# EAGLE design sdr_3157 (EAGLE 9.6.2)
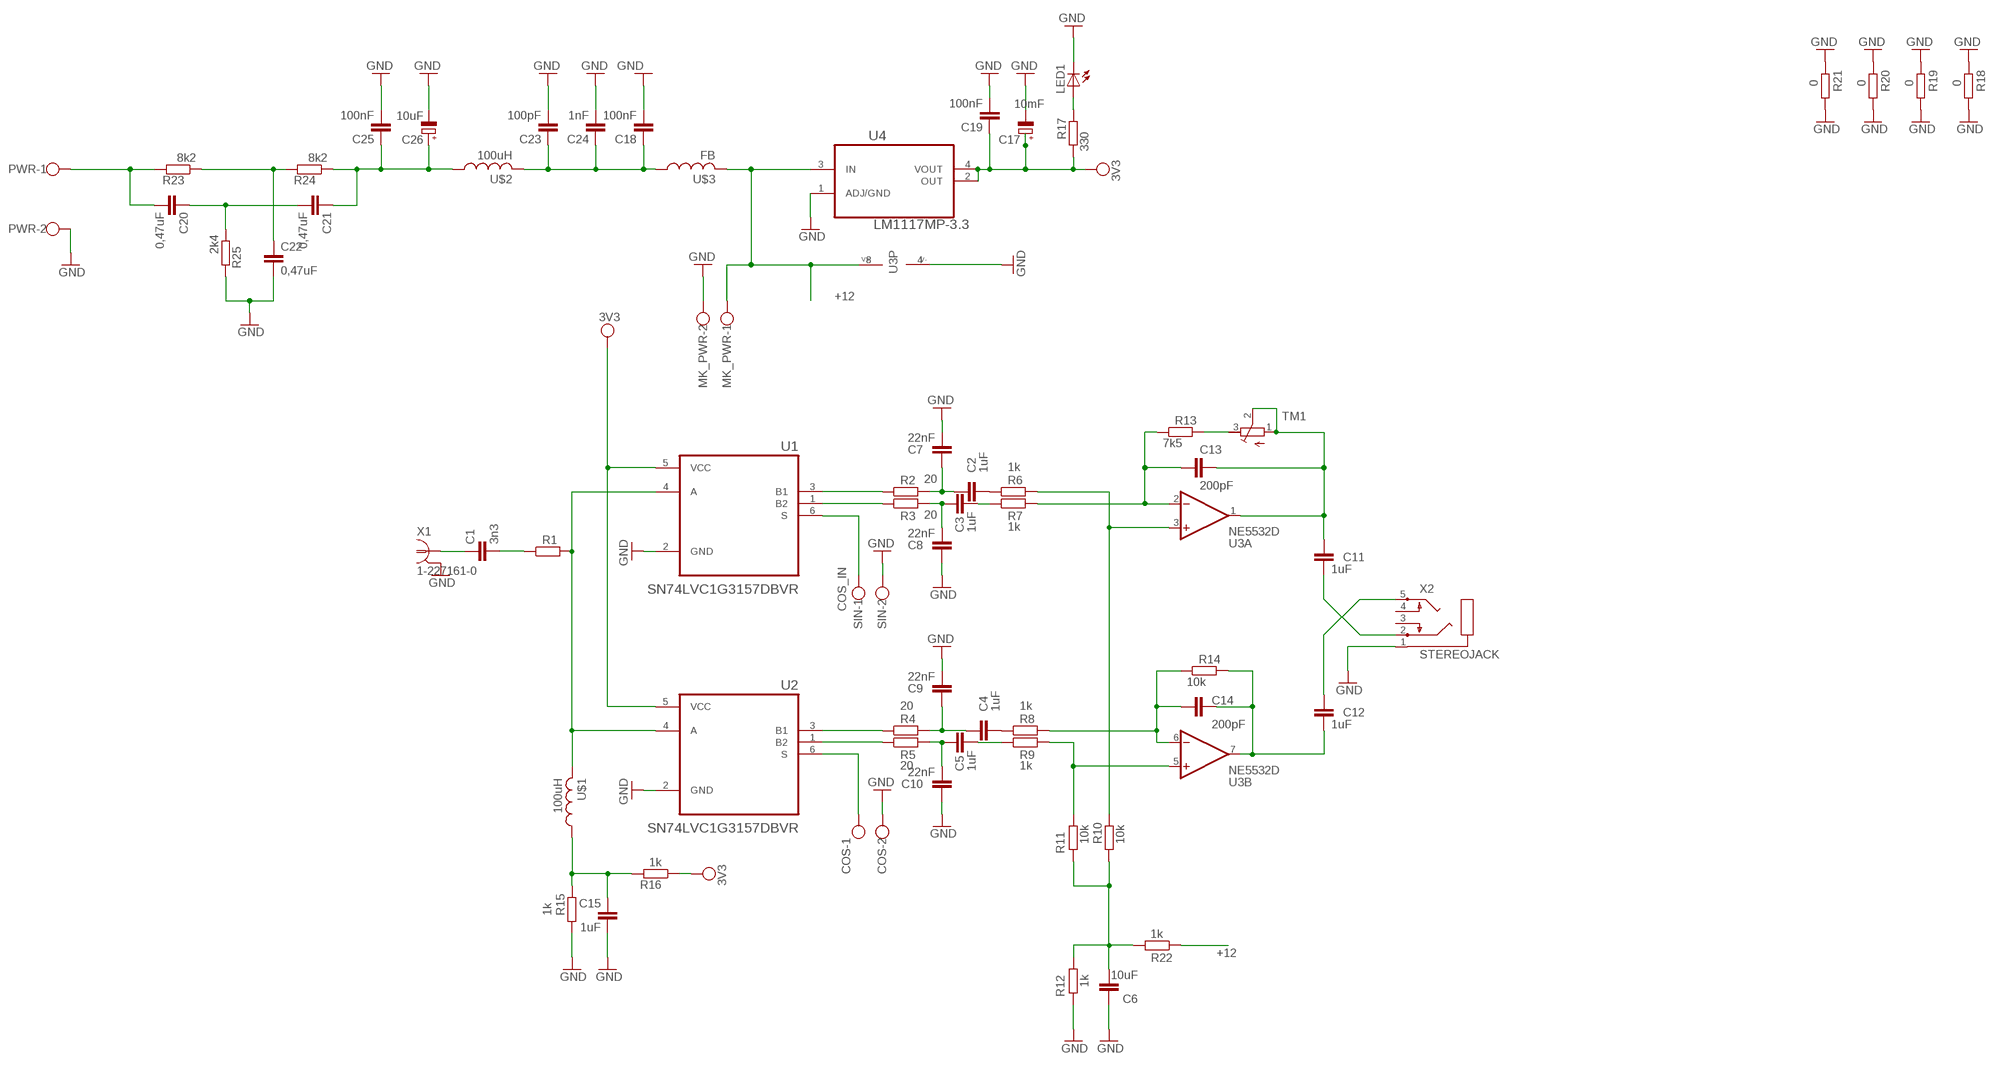
[diagram p0: schematic, sheet 1]

## Parts
C1  3n3  C-EUC0805  [C0805]
C2  1uF  C-EUC0805  [C0805]
C3  1uF  C-EUC0805  [C0805]
C4  1uF  C-EUC0805  [C0805]
C5  1uF  C-EUC0805  [C0805]
C6  10uF  C-EUC0805  [C0805]
C7  22nF  C-EUC0805  [C0805]
C8  22nF  C-EUC0805  [C0805]
C9  22nF  C-EUC0805  [C0805]
C10  22nF  C-EUC0805  [C0805]
C11  1uF  C-EUC1210K  [C1210K]
C12  1uF  C-EUC1210K  [C1210K]
C13  200pF  C-EUC0805  [C0805]
C14  200pF  C-EUC0805  [C0805]
C15  1uF  C-EUC0805  [C0805]
C17  10mF  CPOL-EUSMCC  [SMC_C]
C18  100nF  C-EUC0805  [C0805]
C19  100nF  C-EUC0805  [C0805]
C20  0,47uF  C-EUC0805  [C0805]
C21  0,47uF  C-EUC0805  [C0805]
C22  0,47uF  C-EUC0805  [C0805]
C23  100pF  C-EUC0805  [C0805]
C24  1nF  C-EUC0805  [C0805]
C25  100nF  C-EUC0805  [C0805]
C26  10uF  CPOL-EUSMCC  [SMC_C]
COS  W237-102  [W237-102]
LED1  LEDSMT1206  [1206]
MK_PWR  W237-102  [W237-102]
PWR  W237-102  [W237-102]
R1  R-EU_R0805  [R0805]
R2  20  R-EU_R0805  [R0805]
R3  20  R-EU_R0805  [R0805]
R4  20  R-EU_R0805  [R0805]
R5  20  R-EU_R0805  [R0805]
R6  1k  R-EU_R0805  [R0805]
R7  1k  R-EU_R0805  [R0805]
R8  1k  R-EU_0204/7  [0204/7]
R9  1k  R-EU_R0805  [R0805]
R10  10k  R-EU_R0805  [R0805]
R11  10k  R-EU_0207/12  [0207/12]
R12  1k  R-EU_M0805  [M0805]
R13  7k5  R-EU_R0805  [R0805]
R14  10k  R-EU_R0805  [R0805]
R15  1k  R-EU_R0805  [R0805]
R16  1k  R-EU_R0805  [R0805]
R17  330  R-EU_R0805  [R0805]
R18  0  R-EU_0207/12  [0207/12]
R19  0  R-EU_0207/5V  [0207/5V]
R20  0  R-EU_0204/7  [0204/7]
R21  0  R-EU_0207/12  [0207/12]
R22  1k  R-EU_M0805  [M0805]
R23  8k2  R-EU_R0805  [R0805]
R24  8k2  R-EU_R0805  [R0805]
R25  2k4  R-EU_R0805  [R0805]
SIN  W237-102  [W237-102]
TM1  5k  R-TRIMM3296W  [RTRIM3296W]
U1  SN74LVC1G3157DBVR  [SOT95P280X145-6N]
U2  SN74LVC1G3157DBVR  [SOT95P280X145-6N]
U3  NE5532D  [SO08]
U4  LM1117MP-3.3  [SOT230P696X180-4N]
U$1  100uH  L-LQH55  [LQH55]
U$2  100uH  L-LQH55  [LQH55]
U$3  FB  [FB]
X1  1-227161-0  [AMP_227161]
X2  STEREOJACK  [STX3100]

## Nets
+12: MK_PWR.1 R22.1 U3.8(P:V+) U4.3(IN) U$3.P$2
COS_IN: SIN.1 U1.6(S)
GND: C6.1 C7.2 C8.1 C9.2 C10.1 C15.1 C17.- C18.2 C19.2 C22.2 C23.2 C24.2 C25.2 C26.- COS.2 LED1.C MK_PWR.2 PWR.2 R12.1 R15.1 R18.1 R18.2 R19.1 R19.2 R20.1 R20.2 R21.1 R21.2 R25.2 SIN.2 U1.2(GND) U2.2(GND) U3.4(P:V-) U4.1(ADJ/GND) X1.2 X2.1
N$1: R1.2 U1.4(A) U2.4(A) U$1.2
N$2: C1.2 R1.1
N$3: R2.1 U1.3(B1)
N$4: R3.1 U1.1(B2)
N$5: R4.1 U2.3(B1)
N$6: C1.1 X1.1
N$7: R5.1 U2.1(B2)
N$8: C2.1 C7.1 R2.2
N$9: C3.1 C8.2 R3.2
N$10: C4.1 C9.1 R4.2
N$11: C5.1 C10.2 R5.2
N$12: C2.2 R6.1
N$13: C3.2 R7.1
N$14: C4.2 R8.1
N$15: C5.2 R9.1
N$16: R6.2 R10.2 U3.3(A:+IN)
N$17: C13.1 R7.2 R13.1 U3.2(A:-IN)
N$18: R9.2 R11.2 U3.5(B:+IN)
N$19: C14.1 R8.2 R14.1 U3.6(B:-IN)
N$20: C6.2 R10.1 R11.1 R12.2 R22.2
N$21: C11.1 C13.2 TM1.1(A) TM1.2(S) U3.1(A:OUT)
N$22: C11.2 X2.2
N$23: C12.1 X2.5
N$24: C12.2 C14.2 R14.2 U3.7(B:OUT)
N$25: C15.2 R15.2 R16.2 U$1.1
N$26: LED1.A R17.2
N$27: C20.2 PWR.1 R23.2
N$28: R13.2 TM1.3(E)
N$29: C22.1 R23.1 R24.2
N$30: C20.1 C21.2 R25.1
N$31: COS.1 U2.6(S)
N$32: C21.1 C25.1 C26.+ R24.1 U$2.1
N$33: C18.1 C23.1 C24.1 U$2.2 U$3.P$1
VCC: C17.+ C19.1 R16.1 R17.1 U1.5(VCC) U2.5(VCC) U4.2(OUT) U4.4(VOUT) ; supply symbol labelled 3V3
Unconnected: X2.3 X2.4

## Library data of the parts
C1-C15 C18-C25 = rcl:C-EU: CAPACITOR, European symbol; SPICEPREFIX: C
C17 C26 = rcl:CPOL-EU: POLARIZED CAPACITOR, European symbol; SPICEPREFIX: C
COS MK_PWR PWR SIN = con-wago-500:W237-102: WAGO SCREW CLAMP; MPN: 237-102; OC_FARNELL: unknown; OC_NEWARK: 70K9898
LED1 = adafruit:LED: LED OSRAM: - CHIPLED LG R971, LG N971, LY N971, LG Q971, LY Q971, LO R971, LY R971 LH N974, LH R974 LS Q976, LO Q976, LY Q976 LO Q996 - Hyper CHIPLED LW Q18S LB Q993, LB Q99A, LB R99A - SideLED LS A670, LO A670, LY A670, LG A670, LP A670 LB A673, LV A673, LT A673, LW A673 LH A674 LY A675 LS A676, LA A676, LO A676, LY A676, LW A676 LS A679, LY A679, LG A679 - Hyper Micro SIDELED® LS Y876, LA Y876, LO Y876, LY Y876 LT Y87S - SmartLED LW L88C, LW L88S LB L89C, LB L89S, LG L890 LS L89K, LO L89K, LY L89K LS L896, LA L896, LO L896, LY L896 - TOPLED LS T670, LO T670, LY T670, LG T670, LP T670 LSG T670, LSP T670, LSY T670, LOP T670, LYG T670 LG T671, LOG T671, LSG T671 LB T673, LV T673, LT T673, LW T673 LH T674 LS T676, LA T676, LO T676, LY T676, LB T676, LH T676, LSB T676, LW T676 LB T67C, LV T67C, LT T67C, LS T67K, LO T67K, LY T67K, LW E67C LS E67B, LA E67B, LO E67B, LY E67B, LB E67C, LV E67C, LT E67C LW T67C LS T679, LY T679, LG T679 LS T770, LO T770, LY T770, LG T770, LP T770 LB T773, LV T773, LT T773, LW T773 LH T774 LS E675, LA E675, LY E675, LS T675 LS T776, LA T776, LO T776, LY T776, LB T776 LHGB T686 LT T68C, LB T68C - Hyper Mini TOPLED® LB M676 - Mini TOPLED Santana® LG M470 LS M47K, LO M47K, LY M47K Source: http://www.osram.convergy.de/
R1-R25 = rcl:R-EU_: RESISTOR, European symbol; SPICEPREFIX: R
TM1 = rcl:R-TRIMM: Trimm resistor; SPICEMODEL: X; SPICEPREFIXL: POT
U1 U2 = SN74LVC1G3157DBVR:SN74LVC1G3157DBVR: Check prices <https://pricing.snapeda.com/parts/SN74LVC1G3157DBVR/Texas%20Instruments/view-part?ref=eda>; AVAILABILITY: In Stock; DESCRIPTION: 5-V, 2:1 (SPDT), 1-channel general-purpose analog switch 6-SOT-23 -40 to 125; MF: Texas Instruments; MP: SN74LVC1G3157DBVR; PACKAGE: SOT-23-6 Texas Instruments; PRICE: None; PURCHASE-URL: https://pricing.snapeda.com/search/part/SN74LVC1G3157DBVR/?ref=eda
U3 = op-amp:NE5532: OP-AMP
U4 = LM1117MP-3.3:LM1117MP-3.3: Linear regulators Check prices <https://pricing.snapeda.com/parts/LM1117MP-3.3/Texas%20Instruments/view-part?ref=eda>; AVAILABILITY: In Stock; DESCRIPTION: Linear Voltage Regulator IC Positive Fixed 1 Output 800mA SOT-223; MF: Texas Instruments; MP: LM1117MP-3.3; PACKAGE: SOT-223-3 Texas Instruments; PRICE: None; PURCHASE-URL: https://pricing.snapeda.com/search/part/LM1117MP-3.3/?ref=eda
U$1 U$2 = adafruit:L
U$3 = adafruit:FB: Ferrite bead Digikey #P9821BK-ND
X1 = !con-coax:?227161*: JACK, RIGHT ANGLE, 50 OHM, PCB, BNC Source: amp_227161.pdf; MF: TYCO ELECTRONICS; MPN: 1-227161; OC_FARNELL: unknown; OC_NEWARK: 33B3200
X2 = adafruit:STEREOJACK: MIC/HEADPHONE JACK Stereo jack with two switches. Kycon STX3100, CUI SJ1-3555NG and/or 4UCon 05544

## Board
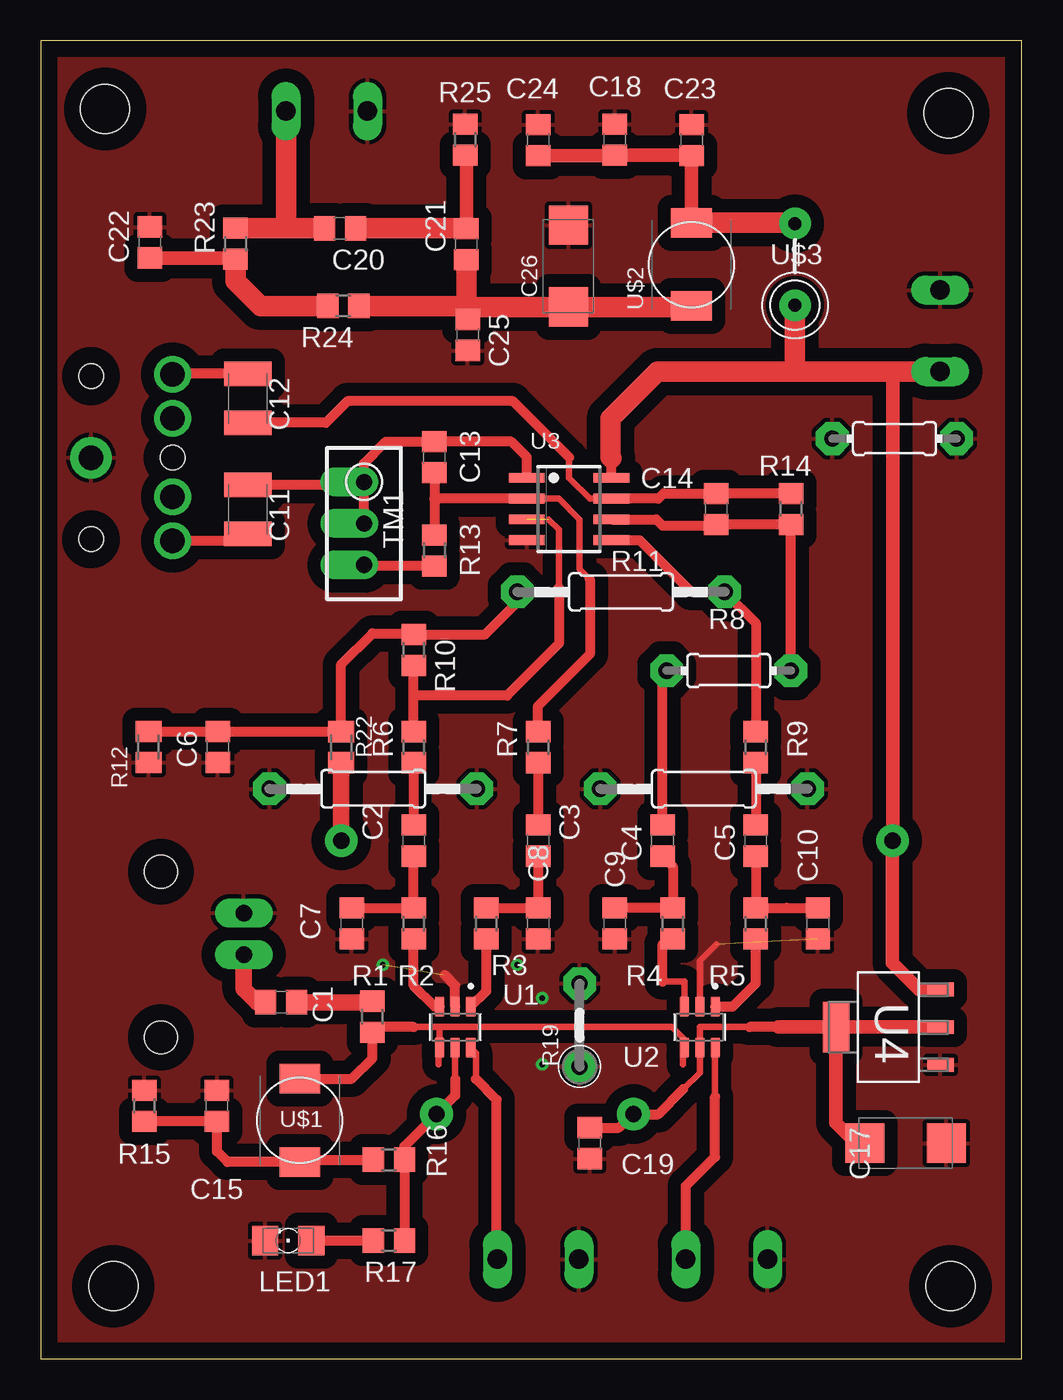
[diagram p1: board, top side]
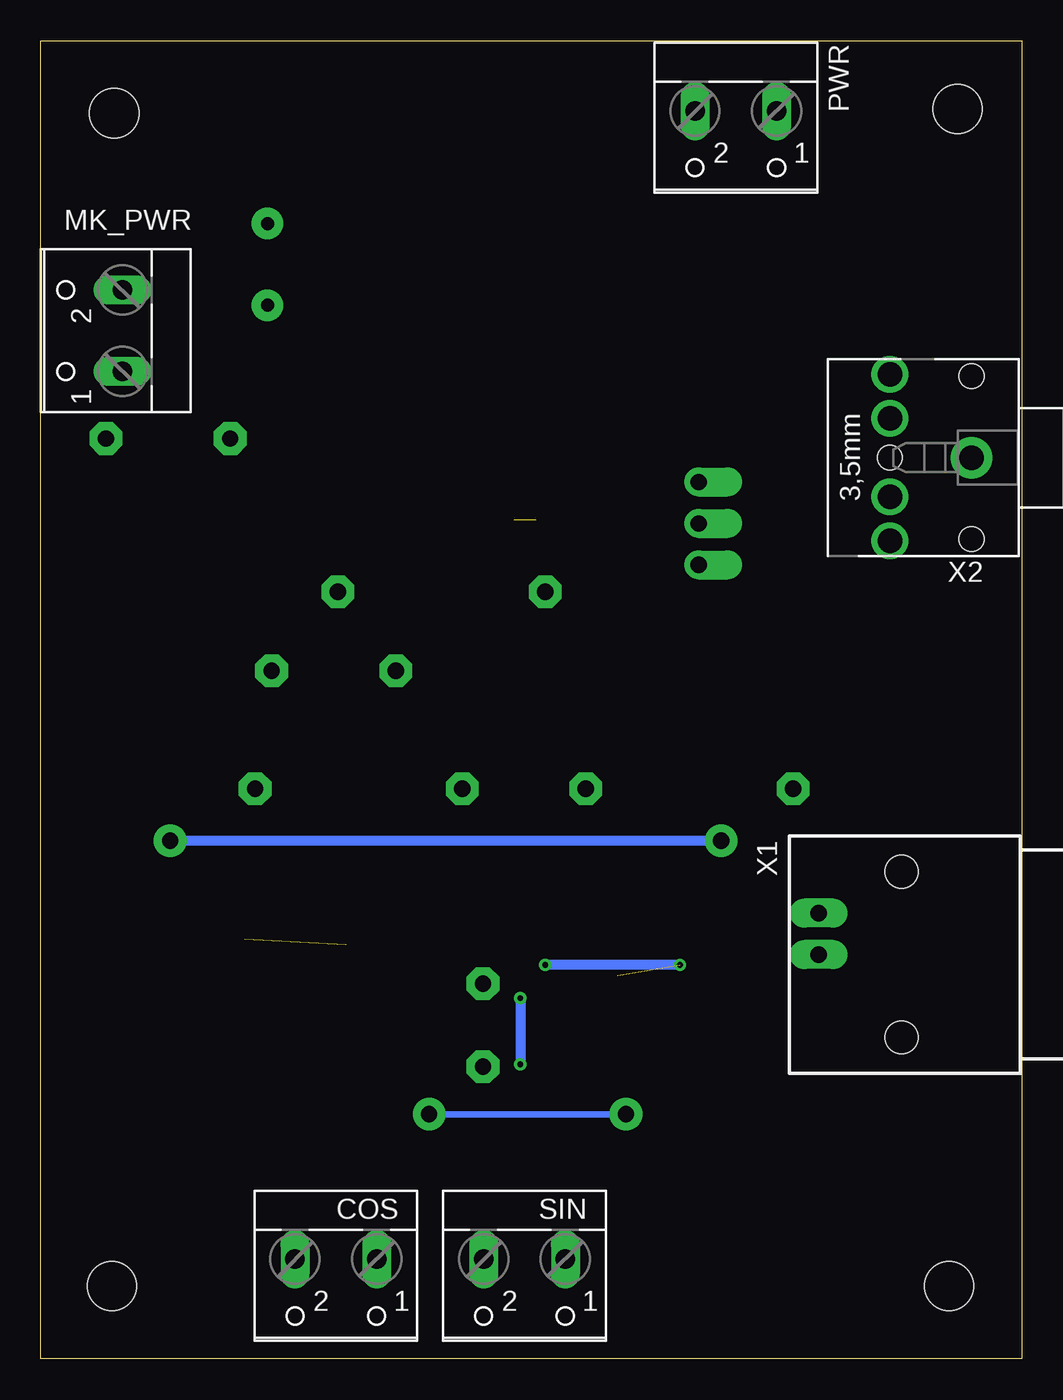
[diagram p2: board, bottom side, seen from below]

Size 60.12 x 80.76 mm. Coordinates in mm from the lower left corner, seen from the top.
Outline: 0,0 60.12,0 60.12,80.76 0,80.76 0,0
Copper layers (1*16): Top 0.035mm / dielectric 1.5mm / Bottom 0.035mm
Design rules "default": minimum track width 6mil, minimum drill 0.35mm, track to track 6mil, track to pad 6mil, pad to pad 6mil, via to via 6mil, smd to smd 6mil, copper to edge 40mil, drill to drill 6mil, minimum pad ring 10mil, minimum via ring 8mil, stop-mask expansion 4mil, vias tented up to drill 0mil, thermal gap 10mil
Holes 3 mm at 4.45,4.45 3.94,76.58 55.63,76.33 55.75,4.45

### Footprints (pad centres in the part's own frame; a part is rotated, then mirrored left to right if it is on the bottom)
C0805 = smd 1.3 x 1.5: 1 -0.95,0; 2 0.95,0
C1210K = smd 1.5 x 2.9: 1 -1.5,0; 2 1.5,0
SMC_C = smd 2.4 x 2.4: + -2.5,0; - 2.5,0
W237-102 = drill 1.194 long: 1 -2.5,-1.27; 2 2.5,-1.27
1206 = smd 1.6 x 1.803: A -1.422,0; C 1.422,0
R0805 = smd 1.3 x 1.5: 1 -0.95,0; 2 0.95,0
0204/7 = drill 1 pad 2 octagon: 1 -3.81,0; 2 3.81,0
0207/12 = drill 1 pad 2 octagon: 1 -6.35,0; 2 6.35,0
M0805 = smd 1.3 x 1.6: 1 -0.95,0; 2 0.95,0
0207/5V = drill 1 pad 2 octagon: 1 -2.54,0; 2 2.54,0
RTRIM3296W = drill 1 pad 1.778 offset: 1 0,-2.54; 2 0,0; 3 0,2.54
SOT95P280X145-6N = smd 1.21 x 0.58: 1 -1.255,0.95; 2 -1.255,0; 3 -1.255,-0.95; 4 1.255,-0.95; 5 1.255,0; 6 1.255,0.95
SO08 = smd 0.6 x 2.2: 1 -1.905,-2.6; 2 -0.635,-2.6; 3 0.635,-2.6; 4 1.905,-2.6; 5 1.905,2.6; 6 0.635,2.6; 7 -0.635,2.6; 8 -1.905,2.6
SOT230P696X180-4N = smd 1.6 x 0.838: 1 -3.2,2.311; 2 -3.2,0; 3 -3.2,-2.311 | smd 1.6 x 3.099: 4 3.2,0
LQH55 = smd 1.8 x 2.5: 1 -2.55,0; 2 2.55,0
FB = drill 0.8 pad 1.93: P$1 -2.5,0; P$2 2.5,0
AMP_227161 = drill 1 pad 1.778 long: 1 0,-5.08; 2 -2.54,-5.08 | hole 2: -5.08,0; 5.08,0
STX3100 = drill 1.5 pad 2.54: 1 2.7,-0.1 | drill 1.5: 2 7.7,5; 3 7.7,2.3; 4 7.7,-2.5; 5 7.7,-5.2 | hole 1.5: 2.7,4.9; 2.7,-5.1; 7.7,-0.1

### Placement (x,y rotation side)
C1  14.73,21.84 0 top
C2  22.86,31.75 90 top
C3  30.48,31.75 90 top
C4  38.1,31.75 90 top
C5  43.81,31.75 90 top
C6  10.85,37.49 90 top
C7  19.05,26.67 270 top
C8  30.48,26.67 90 top
C9  35.18,26.67 270 top
C10  47.62,26.67 90 top
C11  12.7,52.05 270 top
C12  12.7,58.85 270 top
C13  24.13,55.24 90 top
C14  41.4,52.07 90 top
C15  10.79,15.49 270 top
C17  53,13.21 0 top
C18  35.18,74.7 90 top
C19  33.66,13.21 270 top
C20  18.34,69.27 180 top
C21  26.09,68.3 90 top
C22  6.68,68.4 90 top
C23  39.88,74.68 90 top
C24  30.48,74.68 90 top
C25  26.16,62.74 270 top
C26  32.33,66.95 90 top
COS  42.04,4.83 180 bottom
LED1  15.16,7.24 180 top
MK_PWR  56.39,62.99 90 bottom
PWR  17.53,75.18 180 bottom
R1  20.32,20.95 270 top
R2  22.86,26.67 90 top
R3  27.3,26.67 90 top
R4  38.73,26.67 90 top
R5  43.81,26.67 90 top
R6  22.86,37.47 90 top
R7  30.48,37.47 90 top
R8  42.16,42.16 0 top
R9  43.81,37.47 90 top
R10  22.86,43.43 270 top
R11  35.56,46.99 0 top
R12  6.6,37.49 90 top
R13  24.13,49.53 270 top
R14  45.97,52.07 90 top
R15  6.35,15.49 270 top
R16  21.34,12.19 180 top
R17  21.34,7.24 180 top
R18  40.64,34.92 0 top
R19  33.02,20.45 90 top
R20  52.32,56.39 180 top
R21  20.37,34.92 0 top
R22  18.41,37.47 90 top
R23  11.94,68.33 90 top
R24  18.54,64.52 180 top
R25  26.01,74.7 90 top
SIN  30.48,4.83 180 bottom
TM1  19.81,51.18 180 top
U1  25.4,20.32 270 top
U2  40.39,20.32 270 top
U3  32.38,52.07 270 top
U4  51.94,20.32 180 top
U$1  15.88,14.61 90 top
U$2  39.88,67.06 90 top
U$3  46.23,67.06 270 top
X1  7.37,24.77 270 bottom
X2  0.38,55.12 180 bottom

### Tracks (layer width: path | path; a pad name or v marks a point on that pad's centre or on a via)
+12  (via drill 1 pad 2)
  Top 0.61: U3.8 34.98,55.19 | v52.2,31.75 52.22,31.77
  Top 0.813: v52.2,31.75 52.2,24.26 53.82,22.63 U4.3 | 52.32,60.49 52.22,60.39 52.22,31.77
  Top 1.016: R22.1 v18.41,31.75
  Top 1.27: 34.98,55.19 34.92,55.24 34.92,57.61 37.81,60.49 46.23,60.49 | 46.23,60.49 52.32,60.49 MK_PWR.1 | U$3.P$2 46.23,60.49
  Bottom 0.61: v52.2,31.75 v18.41,31.75
COS_IN
  Top 0.406: U1.6 26.67,18.75 26.67,17.14
  Top 0.61: 26.67,17.14 27.94,15.88 27.94,6.14 SIN.1
GND  (via drill 0.35)  (2 unrouted)
  Top 0.406: U2.2 40.39,24.38 41.4,25.4
  Top 0.61: 24.77,23.5 25.4,22.86 U1.2
  Bottom 0.61: v20.95,24.13 v29.21,24.13 | v30.73,22.1 v30.73,18.03
  pour Top (isolate 0.813): 62.61,-3.81 -1.27,-3.81 -1.27,84.71 62.61,84.71
N$1
  Top 0.406: 24.45,20.32 U1.4 24.38,19.07 24.38,18.03 | 24.45,20.32 38.69,20.32 39.44,19.57 U2.4 39.37,19.07 39.37,18.03 | 24.45,20.32 22.86,20.32
  Top 0.61: 22.86,20.32 20.32,20.32 R1.2 20.32,18.41 19.06,17.16 U$1.2
N$2
  Top 1.016: C1.2 20.26,21.84 R1.1
N$3
  Top 0.61: U1.3 24.14,21.57 22.86,22.86 R2.1
N$4
  Top 0.61: U1.1 27.3,22.53 R3.1
N$5
  Top 0.406: U2.3 39.44,23.11 38.1,23.11
  Top 0.61: 38.1,23.11 38.1,25.4 38.42,25.72 R4.1
N$6
  Top 1.016: C1.1 13.27,21.84 12.45,22.67 X1.1
N$7
  Top 0.61: U2.1 42.4,21.57 43.81,22.99 R5.1
N$8
  Top 0.61: C7.1 R2.2 C2.1
N$9
  Top 0.61: R3.2 C8.2 C3.1
N$10
  Top 0.61: C4.1 38.73,30.16 R4.2 C9.1
N$11
  Top 0.61: C5.1 R5.2 45.72,27.62 C10.2
N$12
  Top 0.61: R6.1 22.86,34.29 C2.2
N$13
  Top 0.61: R7.1 C3.2
N$14
  Top 0.61: C4.2 38.1,41.91 R8.1
N$15
  Top 0.61: R9.1 C5.2
N$16  (1 unrouted)
  Top 0.406: 31.11,51.44 31.75,50.8 31.75,47.24
  Top 0.61: R6.2 22.86,40.64 | 22.86,40.64 R10.2 | 31.75,47.24 31.75,43.81 28.57,40.64 22.86,40.64
N$17
  Top 0.406: U3.2 31.75,52.7 33.02,51.44 33.02,48.39 33.66,47.75
  Top 0.61: C13.1 24.13,52.7 | 24.13,52.7 R13.1 | U3.2 24.13,52.7 | 33.66,47.75 33.66,43.18 30.48,40.01 R7.2
N$18
  Top 0.61: R9.2 43.81,45.09 R11.2 39.88,46.99 36.7,50.16 U3.5
N$19
  Top 0.61: U3.6 37.72,51.44 38.1,51.05 41.34,51.05 C14.1 R14.1 R8.2
N$20
  Top 0.61: R11.1 29.21,46.35 27.24,44.38 R10.1 22.79,44.45 20.32,44.45 18.41,42.55 R22.2 18.41,38.41 18.38,38.44 C6.2 R12.2
N$21
  Top 0.61: U3.1 29.79,55.24 28.84,56.2 C13.2 21.14,56.2 19.81,54.86 TM1.1 | TM1.1 19.81,53.55 C11.1 | TM1.2 TM1.1
N$22
  Top 0.61: C11.2 12.27,50.12 X2.2
N$23
  Top 0.61: C12.1 8.12,60.35 X2.5
N$24
  Top 0.406: U3.7 33.66,52.7 32.38,53.98 32.38,55.24
  Top 0.61: R14.2 C14.2 38.16,53.02 37.85,52.7 U3.7 | 32.38,55.24 28.96,58.67 18.8,58.67 17.48,57.35 C12.2
N$25
  Top 0.61: R16.2 16.01,12.19 U$1.1 11.44,12.05 10.79,12.7 C15.2 R15.2
N$26
  Top 0.61: R17.2 LED1.A
N$27
  Top 1.27: R23.2 14.99,69.28 | 14.99,69.28 C20.2 | PWR.1 15.03,69.32 14.99,69.28
N$28
  Top 0.61: R13.2 19.87,48.58 TM1.3
N$29
  Top 0.813: C22.1 11.86,67.45 R23.1
  Top 1.27: R23.1 11.94,66.04 13.46,64.52 R24.2
N$30
  Top 0.813: C21.2 26.09,73.67 R25.1
  Top 1.27: C20.1 26.07,69.27 C21.2
N$31
  Top 0.406: 41.33,16.05 41.33,19.05 U2.6
  Top 0.61: 41.33,16.05 41.33,12.37 39.54,10.58 COS.1
N$32
  Top 1.27: R24.1 25.91,64.52 | 25.91,64.52 26.09,64.69 C21.1 | 25.97,64.45 26.16,64.26 C25.1 | 25.97,64.45 C26.+ 39.83,64.45 U$2.1 | 25.97,64.45 25.91,64.52
N$33
  Top 0.813: C24.1 35.15,73.73 C18.1 39.85,73.75 C23.1 U$2.2
  Top 1.27: U$2.2 46.18,69.61 U$3.P$1
VCC  (via drill 1 pad 2)
  Top 0.406: 43.43,20.32 40.39,20.32 U2.5 40.39,17.53 39.37,16.51 | U1.5 25.4,17.14
  Top 0.61: 45.21,20.32 43.43,20.32 | R17.1 R16.1 22.29,13.02 v24.26,14.99 25.4,16.13 25.4,17.14 | 39.37,16.51 37.85,14.99 v36.32,14.99 36.07,14.73 36.01,14.73 35.43,14.16 C19.1
  Top 0.813: U4.2 U4.4 | 45.21,20.32 U4.4 | C17.+ 49.99,13.21 48.74,14.46 U4.4
  Bottom 0.406: v36.32,14.99 v24.26,14.99